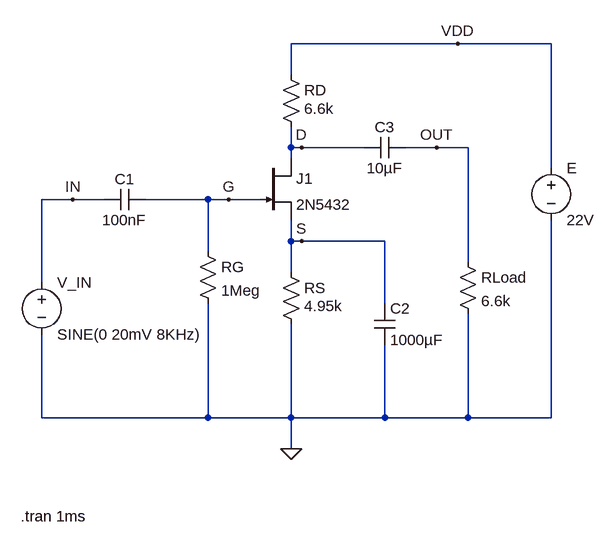
[diagram p0: schematic Amplificator cu TECJ.asc]
Amplificator cu TECJ.asc, the LTspice schematic file:
Version 4.1
SHEET 1 880 680
WIRE 480 -64 224 -64
WIRE 624 -64 480 -64
WIRE 224 -16 224 -64
WIRE 224 96 224 64
WIRE 240 96 224 96
WIRE 336 96 240 96
WIRE 448 96 400 96
WIRE 496 96 448 96
WIRE 224 112 224 96
WIRE 624 128 624 -64
WIRE -112 176 -160 176
WIRE -64 176 -112 176
WIRE 96 176 0 176
WIRE 128 176 96 176
WIRE 176 176 128 176
WIRE 224 240 224 208
WIRE 240 240 224 240
WIRE 368 240 240 240
WIRE 96 256 96 176
WIRE 496 272 496 96
WIRE 224 288 224 240
WIRE -160 304 -160 176
WIRE 368 336 368 240
WIRE -160 512 -160 384
WIRE 96 512 96 336
WIRE 96 512 -160 512
WIRE 224 512 224 368
WIRE 224 512 96 512
WIRE 368 512 368 400
WIRE 368 512 224 512
WIRE 496 512 496 352
WIRE 496 512 368 512
WIRE 624 512 624 208
WIRE 624 512 496 512
WIRE 224 560 224 512
FLAG 224 560 0
FLAG 128 176 G
FLAG 480 -64 VDD
FLAG -112 176 IN
FLAG 448 96 OUT
FLAG 240 240 S
FLAG 240 96 D
SYMBOL njf 176 112 R0
SYMATTR InstName J1
SYMATTR Value 2N5432
SYMBOL res 80 240 R0
SYMATTR InstName RG
SYMATTR Value 1Meg
SYMBOL res 208 272 R0
WINDOW 3 36 68 Left 2
SYMATTR Value 4.95k
SYMATTR InstName RS
SYMBOL voltage 624 112 R0
SYMATTR InstName E
SYMATTR Value 22V
SYMBOL res 208 -32 R0
WINDOW 3 36 68 Left 2
SYMATTR Value 6.6k
SYMATTR InstName RD
SYMBOL cap 0 160 R90
WINDOW 0 0 32 VBottom 2
WINDOW 3 32 32 VTop 2
SYMATTR InstName C1
SYMATTR Value 100nF
SYMBOL voltage -160 288 R0
WINDOW 123 0 0 Left 0
WINDOW 39 0 0 Left 0
SYMATTR InstName V_IN
SYMATTR Value SINE(0 20mV 8KHz)
SYMBOL cap 400 80 R90
WINDOW 0 0 32 VBottom 2
WINDOW 3 32 32 VTop 2
SYMATTR InstName C3
SYMATTR Value 10µF
SYMBOL res 480 256 R0
SYMATTR InstName RLoad
SYMATTR Value 6.6k
SYMBOL cap 352 336 R0
SYMATTR InstName C2
SYMATTR Value 1000µF
TEXT -192 664 Left 2 !.tran 1ms

The netlist it stands for:
* Amplificator cu TECJ.asc
J1 D G S 2N5432
RG G 0 1Meg
RS S 0 4.95k
V§E VDD 0 22V
RD VDD D 6.6k
C1 G IN 100nF
V_IN IN 0 SINE(0 20mV 8KHz)
C3 OUT D 10µF
RLoad OUT 0 6.6k
C2 S 0 1000µF
.model NJF NJF
.model PJF PJF
.lib standard.jft
.tran 1ms
.backanno
.end

* Results of the author's LTspice run, read from the files saved beside the schematic
* Operating Point, zero values left out:
*   V(d) = 15.17 V
*   V(g) = 66.12 µV
*   V(s) = 5.121 V
*   V(vdd) = 22 V
*   I(E) = -1.035 mA
*   I(RD) = 1.035 mA
*   I(RG) = 66.12 pA
*   I(RS) = 1.035 mA
*   Id(J1) = 1.035 mA
*   Ig(J1) = -66.12 pA
*   Is(J1) = -1.035 mA
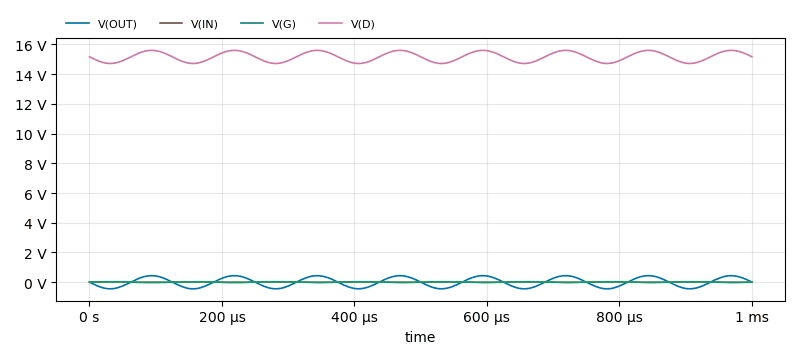
[diagram p1: Transient Analysis of Amplificator cu TECJ.asc, plotted from the saved traces]
* Transient Analysis, 1 run:
*   V(OUT): min -450.5 mV, max 432.3 mV, average -4.375 mV, rms 312.2 mV, last 808.4 µV
*   V(IN): min -20 mV, max 20 mV, average -1.507 µV, rms 14.14 mV, last 0 V
*   V(G): min -19.88 mV, max 20.01 mV, average 60.02 µV, rms 14.1 mV, last 66.25 µV
*   V(D): min 14.72 V, max 15.6 V, average 15.17 V, rms 15.17 V, last 15.17 V